# Altium project H-Bridge.PrjPcb
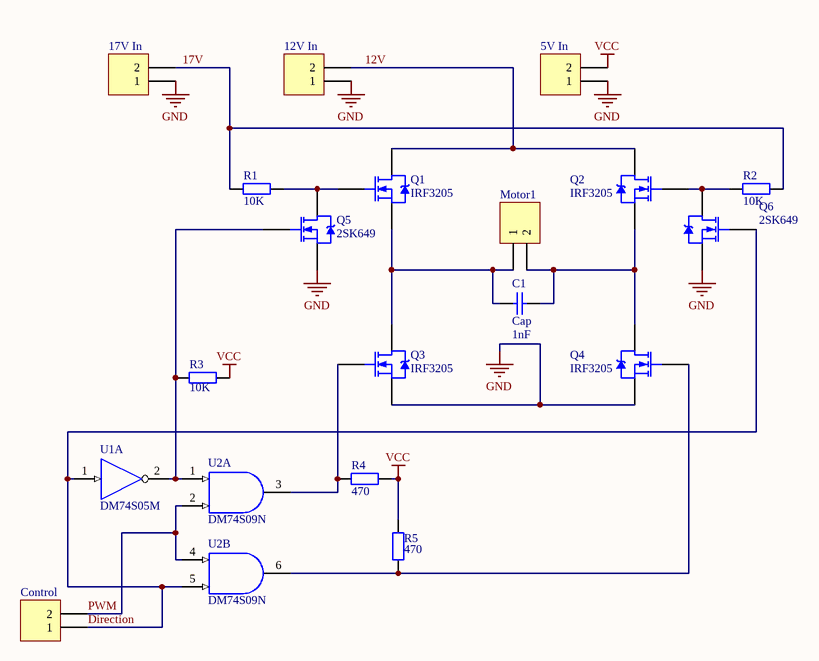
[diagram p0: H-Bridge.SchDoc]
1 sheet, 19 parts. Net scope: global (net labels, ports and power ports of the same name join across sheets).

## Sheet H-Bridge.SchDoc
size A

### Parts
5V_In  Header 2  [HDR1X2]  (value not drawn)
12V_In  Header 2  [HDR1X2]  (value not drawn)
17V_In  Header 2  [HDR1X2]  (value not drawn)
C1  Cap  value 1nF  [RAD-0.3]
Control  Header 2  [HDR1X2]  (value not drawn)
Motor1  Header 2  [HDR1X2]  (value not drawn)
Q1  IRF3205  [TO-220AB]
Q2  IRF3205  [TO-220AB]
Q3  IRF3205  [TO-220AB]
Q4  IRF3205  [TO-220AB]
Q5  2SK649  [TO-92]
Q6  2SK649  [TO-92]
R1  value 10K  [AXIAL-0.4]  (hidden comment: Res2)
R2  value 10K  [AXIAL-0.4]  (hidden comment: Res2)
R3  value 10K  [AXIAL-0.4]  (hidden comment: Res2)
R4  value 470  [AXIAL-0.4]  (hidden comment: Res2)
R5  value 470  [AXIAL-0.4]  (hidden comment: Res2)
U1  DM74S05M  [M14A_N]  (part A of 6)
U2  DM74S09N  [N14A]  (parts A,B of 4)

### Nets
GND: 5V_In.1 12V_In.1 17V_In.1 Q3.3(S) Q4.3(S) Q5.3(S) Q6.3(S) U1.7(GND) U2.7(GND)
VCC: 5V_In.2 R3.1 R4.1 R5.2 U1.14(VCC) U2.14(VCC)
12V: 12V_In.2 Q1.2(D) Q2.2(D)
17V: 17V_In.2 R1.1 R2.1
Direction: Control.1 Q6.1(G) U1.1(A) U2.5(B)
PWM: Control.2 U2.2(B) U2.4(A)
NetC1_1: C1.1 Motor1.1 Q1.3(S) Q3.2(D)
NetC1_2: C1.2 Motor1.2 Q2.3(S) Q4.2(D)
NetQ1_1: Q1.1(G) Q5.2(D) R1.2
NetQ2_1: Q2.1(G) Q6.2(D) R2.2
NetQ3_1: Q3.1(G) R4.2 U2.3(Y)
NetQ4_1: Q4.1(G) R5.1 U2.6(Y)
NetQ5_1: Q5.1(G) R3.2 U1.2(Y) U2.1(A)

### Library data of the parts
5V_In 12V_In 17V_In Control Motor1 = Header 2: Header, 2-Pin; LatestRevisionDate: 17-Jul-2002; LatestRevisionNote: Re-released for DXP Platform.; Publisher: Altium Limited
C1 = Cap: Capacitor; Published: 8-Jun-2000; LatestRevisionDate: 17-Jul-2002; LatestRevisionNote: Re-released for DXP Platform.; PackageReference: RAD-0.3; Publisher: Altium Limited
Q1-Q4 = IRF3205: HEXFET Power MOSFET; Note: Pin 2 is electrically connected to pin 4.; Published: 8-Jun-2000; LatestRevisionDate: 17-Jul-2002; LatestRevisionNote: Re-released for DXP Platform.; DatasheetVersion: Aug-1997; PackageVersion: Feb-1997; PackageReference: TO-220AB; Publisher: Altium Limited; PackageDescription: TO, Thru-Hole, Vertical, Heatsink Mounted; 3 In-Line Leads; Pitch 2.54 mm; ComponentLink1Description: Manufacturer Link; ComponentLink1URL: http://www.irf.com/; ComponentLink2Description: Datasheet; ComponentLink2URL: http://www.irf.com/product-info/datasheets/data/irf3205.pdf
Q5 Q6 = 2SK649: N channel MOSFET; Published: 17-Sep-2003; PackageReference: TO-92; PackageDescription: TO, Thru-Hole, Vertical, Heatsink Mounted; 3 In-Line Leads; Pitch 1.27 mm; Code_JEDEC: TO-92
R1-R5 = Res2: Resistor; Published: 8-Jun-2000; LatestRevisionDate: 17-Jul-2002; LatestRevisionNote: Re-released for DXP Platform.; PackageReference: AXIAL-0.4; Publisher: Altium Limited
U1 = DM74S05M: Hex Inverter with Open-Collector Output, 14-Pin SOIC; IC_Technology: S; Published: 17-Jul-2002; LatestRevisionDate: 13-Apr-2006; LatestRevisionNote: IPC-7351 Footprint Added.; DatasheetVersion: Mar-1998; PackageVersion: 2000; PackageReference: M14A; Publisher: Altium Limited; PackageDescription: 14-Pin Small Outline Integrated Circuit 1.27 mm Pitch; Code_IPC: SOIC127P600-14; ComponentLink1Description: Manufacturer Link; ComponentLink1URL: http://www.fairchildsemi.com/
U2 = DM74S09N: Quad 2-Input AND Gate with Open-Collector Output, 14-Pin PDIP; IC_Technology: S; Published: 17-Jul-2002; LatestRevisionDate: 29-May-2009; LatestRevisionNote: Component Body Added.; DatasheetVersion: Mar-1998; PackageVersion: 2000; PackageReference: N14A; Publisher: Altium Limited; PackageDescription: DIP, 14-Pin, Row Spacing 7.62 mm, Pitch 2.54 mm; ComponentLink1Description: Manufacturer Link; ComponentLink1URL: http://www.fairchildsemi.com/